# Altium schematic sheet Connectors.SchDoc: Connectors
size A4; Author: Kevin Chen; Address1: E5 2001, University of Waterloo; Address2: 200 University Ave W; Address3: Waterloo; Address4: N2L 3E9; DocumentNumber: 2; Revision: 0.1; SheetNumber: 2; SheetTotal: 2; Website: www.uwmidsun.com
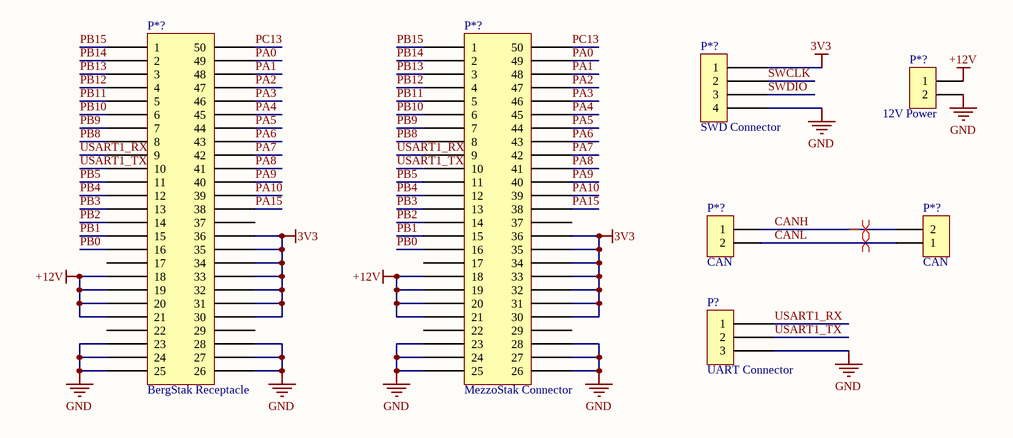
[diagram p0: Connectors.SchDoc]

## Parts
(Parts that share a designator on the sheet are numbered #1, #2 ... from top to bottom, then left to right.)
P*?#1  SWD Connector
P*?#2  12V Power
P*?#3  BergStak Receptacle
P*?#4  MezzoStak Connector  [10106813-051112LF]
P*?#5  CAN
P*?#6  CAN
P?  UART Connector

## Nets
3V3: P*?#1.1 P*?#3.30 P*?#3.31 P*?#3.32 P*?#3.33 P*?#3.34 P*?#3.35 P*?#3.36 P*?#4.30 P*?#4.31 P*?#4.32 P*?#4.33 P*?#4.34 P*?#4.35 P*?#4.36
+12V: P*?#2.1 P*?#3.18 P*?#3.19 P*?#3.20 P*?#3.21 P*?#4.18 P*?#4.19 P*?#4.20 P*?#4.21
GND: P*?#1.4 P*?#2.2 P*?#3.23 P*?#3.24 P*?#3.25 P*?#3.26 P*?#3.27 P*?#3.28 P*?#4.23 P*?#4.24 P*?#4.25 P*?#4.26 P*?#4.27 P*?#4.28 P?.3
CANH: P*?#5.2 P*?#6.1
CANL: P*?#5.1 P*?#6.2
PA0: P*?#3.49 P*?#4.49
PA1: P*?#3.48 P*?#4.48
PA2: P*?#3.47 P*?#4.47
PA3: P*?#3.46 P*?#4.46
PA4: P*?#3.45 P*?#4.45
PA5: P*?#3.44 P*?#4.44
PA6: P*?#3.43 P*?#4.43
PA7: P*?#3.42 P*?#4.42
PA8: P*?#3.41 P*?#4.41
PA9: P*?#3.40 P*?#4.40
PA10: P*?#3.39 P*?#4.39
PA15: P*?#3.38 P*?#4.38
PB0: P*?#3.16 P*?#4.16
PB1: P*?#3.15 P*?#4.15
PB2: P*?#3.14 P*?#4.14
PB3: P*?#3.13 P*?#4.13
PB4: P*?#3.12 P*?#4.12
PB5: P*?#3.11 P*?#4.11
PB8: P*?#3.8 P*?#4.8
PB9: P*?#3.7 P*?#4.7
PB10: P*?#3.6 P*?#4.6
PB11: P*?#3.5 P*?#4.5
PB12: P*?#3.4 P*?#4.4
PB13: P*?#3.3 P*?#4.3
PB14: P*?#3.2 P*?#4.2
PB15: P*?#3.1 P*?#4.1
PC13: P*?#3.50 P*?#4.50
SWCLK: P*?#1.2
SWDIO: P*?#1.3
USART1_RX: P*?#3.9 P*?#4.9 P?.1
USART1_TX: P*?#3.10 P*?#4.10 P?.2

Not connected (* = marked no-connect by the designer): P*?#3 17 22 29 37; P*?#4 17 22 29 37

## Layout directives
differential pair: CANH, CANL

## Notes on the sheet
- Project:
- Title:
- Size:
- Project Lead:
- A4
- Document Number:
- Revision:
- Date:
- Sheet
- of
- Website:

## Library data of the parts
P*?#1 = 4 Position Clik-Mate SWD Connector: 4 Position Receptacle Connector 0.059" (1.50mm) Surface Mount Gold; Maufacturer Part Number: 5054050470; Digikey Part Number: WM12858CT-ND
P*?#2 = 2 Position Clik-Mate 12V Connector: 2 Position Receptacle Connector 0.059" (1.50mm) Surface Mount Tin; Manufacturer Part Number: 5025840270; Digikey Part Number: WM9811CT-ND
P*?#3 = BergStak 50 Position Connector Receptacle: 50 Position Connector Receptacle, Center Strip Contacts Surface Mount Gold; Manufacturer Part Number: 10132798-052100LF; Digikey Part Number: 609-5227-1-ND
P*?#4 = 10106813-051112LF: 50 Position Connector Self Mating, Non-Gendered Surface Mount Gold or Gold, GXT™; Digikey Part Number: 609-4602-1-ND; Manufacturer Part Number: 10106813-051112LF
P*?#5 P*?#6 = 2 Position Clik-Mate CAN Connector: 2 Position Receptacle Connector 0.049" (1.25mm) Surface Mount Tin; Manufacturer Part Number: 5023820270; Digikey Part Number: WM4780CT-ND
P? = 3 Position Clik-Mate UART Connector: 3 Position Receptacle Connector 0.049" (1.25mm) Surface Mount Tin; Maufacturer Part Number: 5023820370; Digikey Part Number: WM3918CT-ND; ComponentLink1Description: datasheet; ComponentLink1URL: http://www.molex.com/pdm_docs/sd/5023820370_sd.pdf